# Altium project SAMD21_Xplained_Pro.PrjPCB (part 2 of 2)
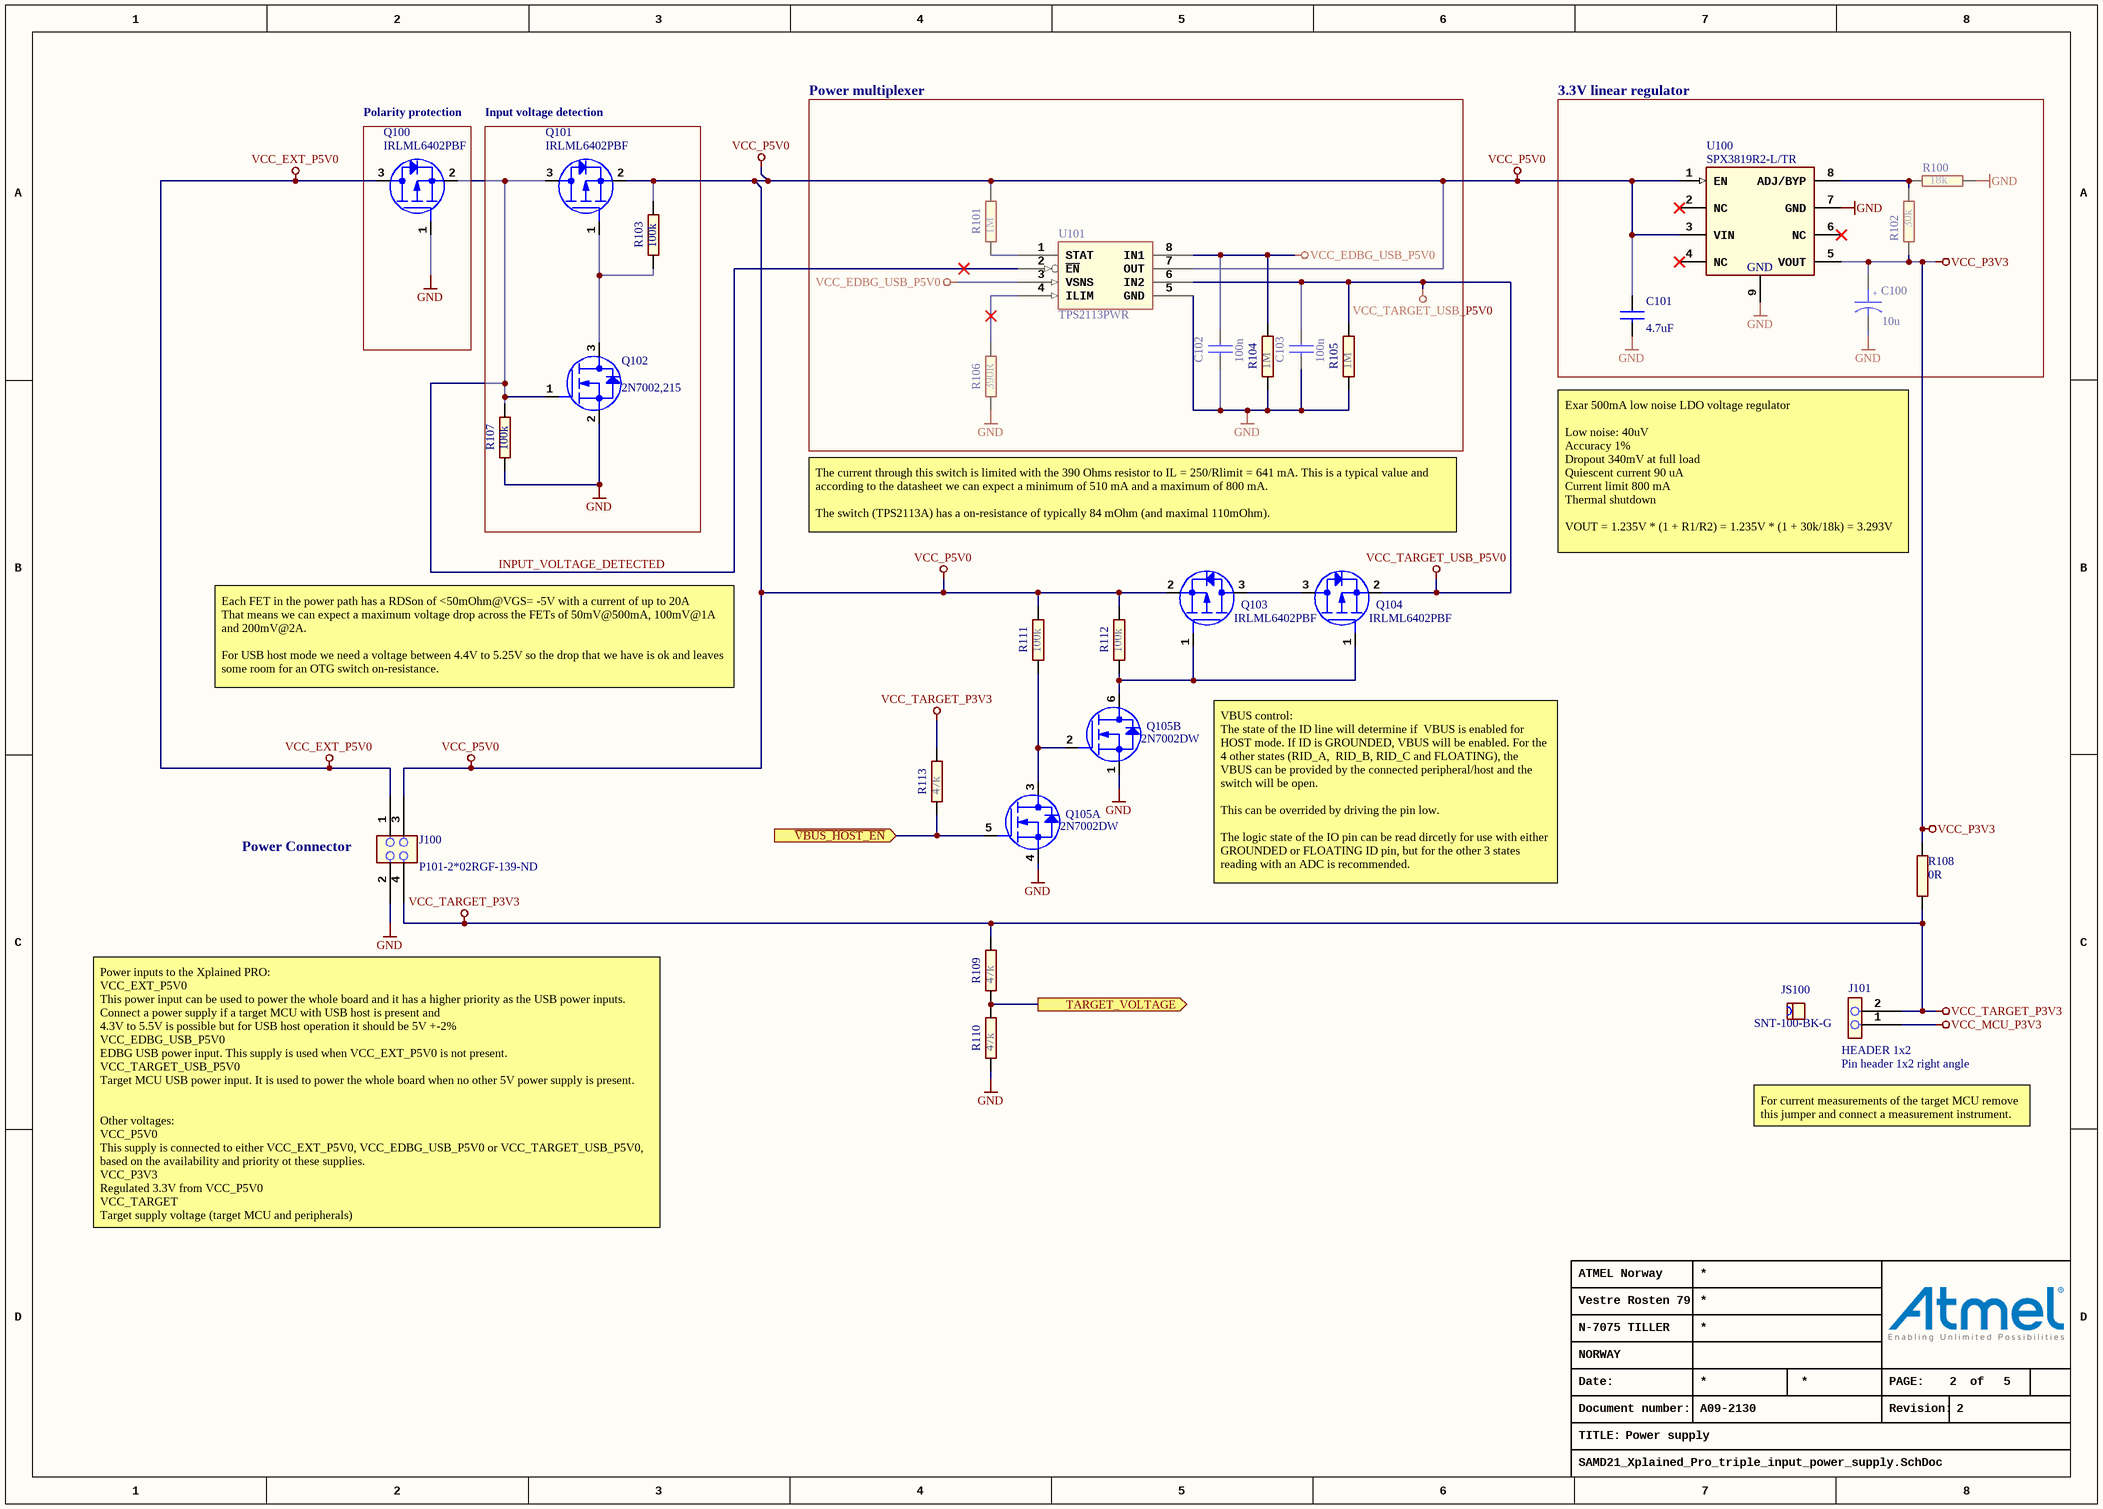
[diagram p5: SAMD21_Xplained_Pro_triple_input_power_supply.SchDoc]

## Nets that join several sheets
GND: SAMD21_Xplained_Pro_Target_MCU (27 pins), SAMD21_Xplained_Pro_EDBG (33 pins), SAMD21_Xplained_Pro_Connectors (6 pins), SAMD21_Xplained_Pro_triple_input_power_supply (18 pins)
VCC_EDBG_USB_P5V0: SAMD21_Xplained_Pro_EDBG (C408.1 L401.2 U400.A10), SAMD21_Xplained_Pro_triple_input_power_supply (C102.1 R104.2 U101.3 U101.8)
VCC_MCU_P3V3: SAMD21_Xplained_Pro_Target_MCU (9 pins), SAMD21_Xplained_Pro_triple_input_power_supply (J101.1)
VCC_P3V3: SAMD21_Xplained_Pro_EDBG (R425.2), SAMD21_Xplained_Pro_triple_input_power_supply (C100.1 R102.1 R108.1 U100.5)
VCC_TARGET_P3V3: SAMD21_Xplained_Pro_Target_MCU (9 pins), SAMD21_Xplained_Pro_Connectors (J200.20 J201.20 J202.20), SAMD21_Xplained_Pro_triple_input_power_supply (5 pins)
VCC_TARGET_USB_P5V0: SAMD21_Xplained_Pro_Target_MCU (D300.4 J300.1 R307.2), SAMD21_Xplained_Pro_triple_input_power_supply (C103.1 Q104.2 R105.2 U101.6)
EDBG_ADC0: SAMD21_Xplained_Pro_EDBG (U400.K10), SAMD21_Xplained_Pro_triple_input_power_supply (R109.1 R110.2)
EDBG_CDC_USART_RX: SAMD21_Xplained_Pro_Target_MCU (U300.43), SAMD21_Xplained_Pro_EDBG (U400.F9)
EDBG_DGI_SCL: SAMD21_Xplained_Pro_Target_MCU (R305.1 U300.18), SAMD21_Xplained_Pro_EDBG (U400.F7), SAMD21_Xplained_Pro_Connectors (J200.12 J201.12 J202.12)
EDBG_DGI_SDA: SAMD21_Xplained_Pro_Target_MCU (R306.1 U300.17), SAMD21_Xplained_Pro_EDBG (U400.G7), SAMD21_Xplained_Pro_Connectors (J200.11 J201.11 J202.11)
EDBG_SPI_DGI_MOSI: SAMD21_Xplained_Pro_Target_MCU (U300.49 U301.5), SAMD21_Xplained_Pro_EDBG (U400.K3), SAMD21_Xplained_Pro_Connectors (J202.16)
EDBG_SPI_DGI_SCK: SAMD21_Xplained_Pro_Target_MCU (U300.50 U301.6), SAMD21_Xplained_Pro_EDBG (U400.J4), SAMD21_Xplained_Pro_Connectors (J202.18)
EDBG_SPI_DGI_SS: SAMD21_Xplained_Pro_Target_MCU (U300.60), SAMD21_Xplained_Pro_EDBG (U400.G5)
ID1: SAMD21_Xplained_Pro_EDBG (R409.1 U400.A1), SAMD21_Xplained_Pro_Connectors (J200.1)
ID2: SAMD21_Xplained_Pro_EDBG (R402.1 U400.B2), SAMD21_Xplained_Pro_Connectors (J201.1)
ID3: SAMD21_Xplained_Pro_EDBG (R401.1 U400.B3), SAMD21_Xplained_Pro_Connectors (J202.1)
PA02_ADC0: SAMD21_Xplained_Pro_Target_MCU (U300.3), SAMD21_Xplained_Pro_Connectors (J202.3)
PA03_ADC1: SAMD21_Xplained_Pro_Target_MCU (J307.1), SAMD21_Xplained_Pro_Connectors (J202.4)
PA04_S0_SPI_MISO: SAMD21_Xplained_Pro_Target_MCU (U300.13), SAMD21_Xplained_Pro_Connectors (J200.17)
PA05_S0_SPI_SS: SAMD21_Xplained_Pro_Target_MCU (U300.14), SAMD21_Xplained_Pro_Connectors (J200.15)
PA06_S0_SPI_MOSI: SAMD21_Xplained_Pro_Target_MCU (U300.15), SAMD21_Xplained_Pro_Connectors (J200.16)
PA07_S0_SPI_SCK: SAMD21_Xplained_Pro_Target_MCU (U300.16), SAMD21_Xplained_Pro_Connectors (J200.18)
PA10_ADC18: SAMD21_Xplained_Pro_Target_MCU (U300.19), SAMD21_Xplained_Pro_Connectors (J201.3)
PA11_ADC19: SAMD21_Xplained_Pro_Target_MCU (U300.20), SAMD21_Xplained_Pro_Connectors (J201.4)
PA12_PWM_TC2_0: SAMD21_Xplained_Pro_Target_MCU (U300.29), SAMD21_Xplained_Pro_Connectors (J202.7)
PA13_PWM_TC2_1: SAMD21_Xplained_Pro_Target_MCU (R313.1), SAMD21_Xplained_Pro_Connectors (J202.8)
PA15_GPIO_BTN: SAMD21_Xplained_Pro_Target_MCU (R302.2 U300.32), SAMD21_Xplained_Pro_Connectors (J202.6)
PA16_S1_SPI_MISO: SAMD21_Xplained_Pro_Target_MCU (U300.35), SAMD21_Xplained_Pro_Connectors (J201.17)
PA17_S1_SPI_SS: SAMD21_Xplained_Pro_Target_MCU (U300.36), SAMD21_Xplained_Pro_Connectors (J201.15)
PA18_S1_SPI_MOSI: SAMD21_Xplained_Pro_Target_MCU (U300.37), SAMD21_Xplained_Pro_Connectors (J201.16)
PA19_S1_SPI_SCK: SAMD21_Xplained_Pro_Target_MCU (U300.38), SAMD21_Xplained_Pro_Connectors (J201.18)
PA20_GPIO: SAMD21_Xplained_Pro_Target_MCU (U300.41), SAMD21_Xplained_Pro_EDBG (R418.1), SAMD21_Xplained_Pro_Connectors (J201.5)
PA21_GPIO: SAMD21_Xplained_Pro_Target_MCU (U300.42), SAMD21_Xplained_Pro_EDBG (R419.1), SAMD21_Xplained_Pro_Connectors (J201.6)
PA23_S3_UART_RX: SAMD21_Xplained_Pro_Target_MCU (U300.44), SAMD21_Xplained_Pro_EDBG (R414.1)
PA27_GPIO_SS: SAMD21_Xplained_Pro_Target_MCU (U300.51), SAMD21_Xplained_Pro_EDBG (R416.1), SAMD21_Xplained_Pro_Connectors (J202.10)
PA28_GPIO_IRQ8: SAMD21_Xplained_Pro_Target_MCU (U300.53), SAMD21_Xplained_Pro_EDBG (R417.1), SAMD21_Xplained_Pro_Connectors (J202.9)
PA30_SWDCLK: SAMD21_Xplained_Pro_Target_MCU (U300.57), SAMD21_Xplained_Pro_EDBG (U400.D6)
PA31_SWDIO: SAMD21_Xplained_Pro_Target_MCU (U300.58), SAMD21_Xplained_Pro_EDBG (U400.C5)
PB00_ADC8: SAMD21_Xplained_Pro_Target_MCU (U300.61), SAMD21_Xplained_Pro_Connectors (J200.3)
PB01_ADC9: SAMD21_Xplained_Pro_Target_MCU (U300.62), SAMD21_Xplained_Pro_Connectors (J200.4)
PB02_PWM_TC6_0: SAMD21_Xplained_Pro_Target_MCU (U300.63), SAMD21_Xplained_Pro_Connectors (J200.7)
PB03_PWM_TC6_1: SAMD21_Xplained_Pro_Target_MCU (U300.64), SAMD21_Xplained_Pro_Connectors (J200.8)
PB04_GPIO_IRQ4: SAMD21_Xplained_Pro_Target_MCU (U300.5), SAMD21_Xplained_Pro_Connectors (J200.9)
PB05_GPIO_SS: SAMD21_Xplained_Pro_Target_MCU (U300.6), SAMD21_Xplained_Pro_Connectors (J200.10)
PB06_GPIO: SAMD21_Xplained_Pro_Target_MCU (U300.9), SAMD21_Xplained_Pro_Connectors (J200.5)
PB07_GPIO: SAMD21_Xplained_Pro_Target_MCU (U300.10), SAMD21_Xplained_Pro_Connectors (J200.6)
PB08_S4_UART_TX: SAMD21_Xplained_Pro_Target_MCU (U300.11), SAMD21_Xplained_Pro_Connectors (J200.14)
PB09_S4_UART_RX: SAMD21_Xplained_Pro_Target_MCU (U300.12), SAMD21_Xplained_Pro_Connectors (J200.13)
PB10_S4_UART_TX: SAMD21_Xplained_Pro_Target_MCU (U300.23), SAMD21_Xplained_Pro_Connectors (J201.14 J202.14)
PB11_S4_UART_RX: SAMD21_Xplained_Pro_Target_MCU (U300.24), SAMD21_Xplained_Pro_Connectors (J201.13 J202.13)
PB12_PWM_TC4_0: SAMD21_Xplained_Pro_Target_MCU (U300.25), SAMD21_Xplained_Pro_Connectors (J201.7)
PB13_PWM_TC4_1: SAMD21_Xplained_Pro_Target_MCU (U300.26), SAMD21_Xplained_Pro_Connectors (J201.8)
PB14_GPIO_IRQ14: SAMD21_Xplained_Pro_Target_MCU (U300.27), SAMD21_Xplained_Pro_Connectors (J201.9)
PB15_GPIO_SS: SAMD21_Xplained_Pro_Target_MCU (U300.28), SAMD21_Xplained_Pro_Connectors (J201.10)
PB16_S5_SPI_MISO: SAMD21_Xplained_Pro_Target_MCU (U300.39 U301.2), SAMD21_Xplained_Pro_EDBG (R420.2), SAMD21_Xplained_Pro_Connectors (J202.17)
PB17_S5_SPI_SS: SAMD21_Xplained_Pro_Target_MCU (U300.40), SAMD21_Xplained_Pro_Connectors (J202.15)
PB30_GPIO_LED: SAMD21_Xplained_Pro_Target_MCU (D301.1 U300.59), SAMD21_Xplained_Pro_Connectors (J202.5)
TARGET_RESET: SAMD21_Xplained_Pro_Target_MCU (R315.1), SAMD21_Xplained_Pro_EDBG (U400.B4)
TARGET_RESET_SENSE: SAMD21_Xplained_Pro_Target_MCU (5 pins), SAMD21_Xplained_Pro_EDBG (U400.H2)
TARGET_USB_ID: SAMD21_Xplained_Pro_Target_MCU (J300.4 R309.1), SAMD21_Xplained_Pro_triple_input_power_supply (Q105.5 R113.1)

## Assembly variants
Default_assembly: not fitted C300 C403 R301 R313 R424